# Altium schematic sheet ui_bt_audio.SchDoc: mcHF Pro Transceiver UI board
size A3; Author: Krassi Atanassov; CompanyName: MØNKA; Engineer: For radio amateurs experimentation, non-commercial use only. Thank you!; Revision: 0.8.5; SheetTotal: 13
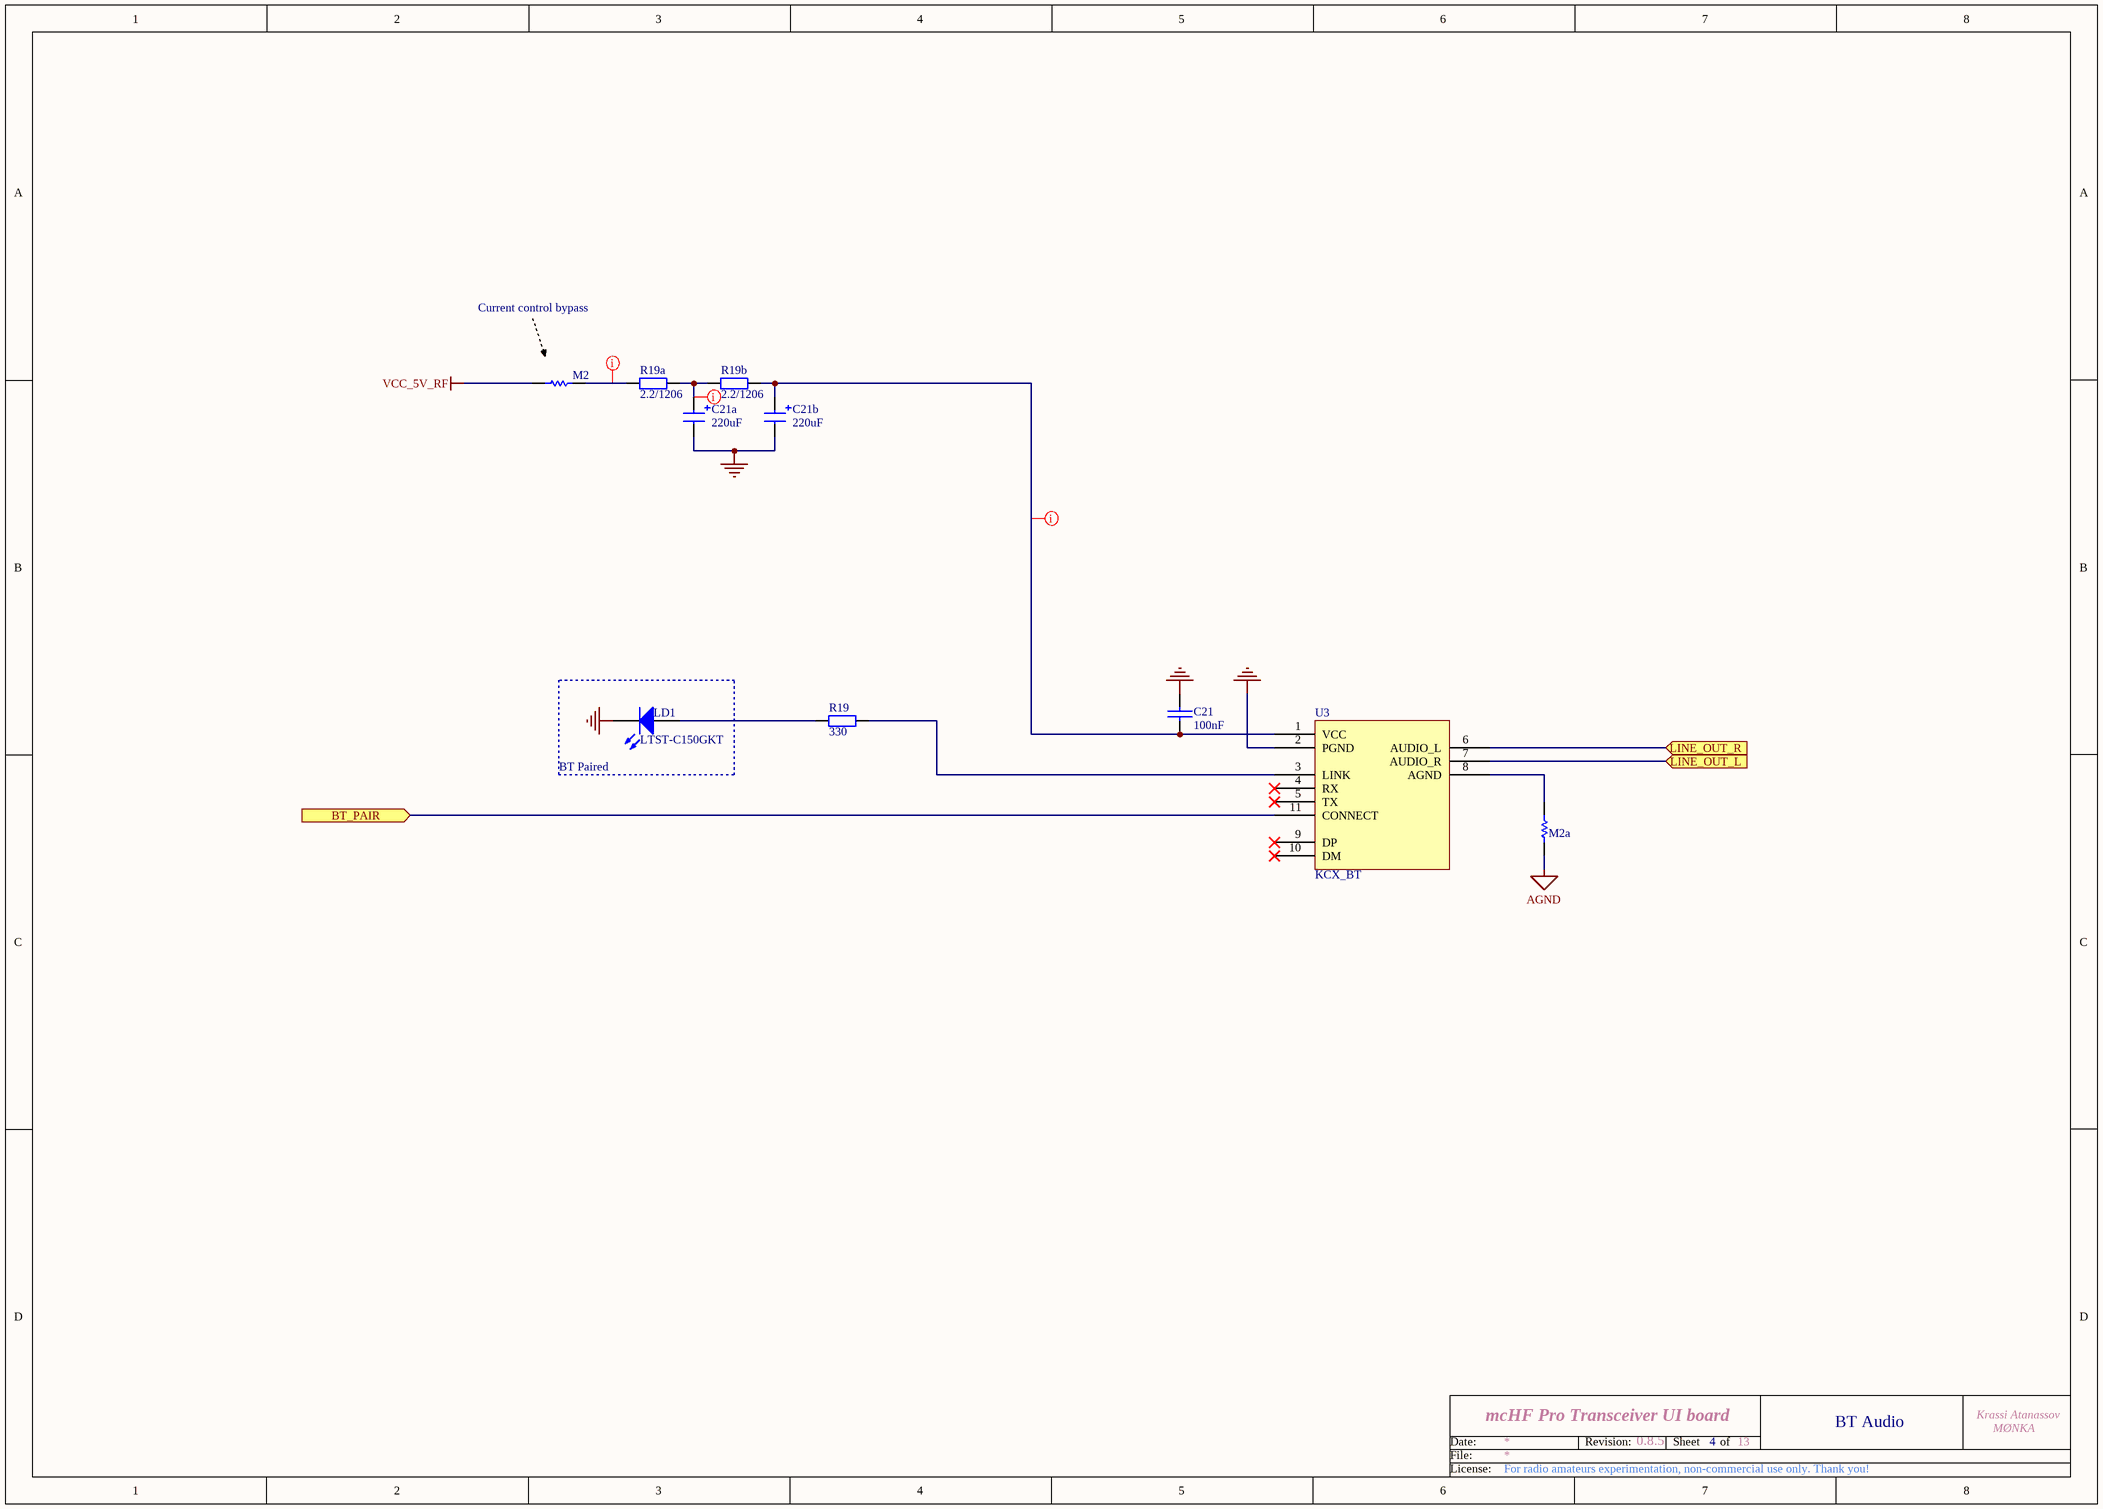
[diagram p0: ui_bt_audio.SchDoc]

## Parts
C21  100nF  [0805]
C21a  220uF  [CAP_ALUM_Pro]
C21b  220uF  [CAP_ALUM_Pro]
LD1  LTST-C150GKT  [1206_Elec_Cap]  (no BOM)
M2  0  [SB_0603]  (value not drawn)  (net tie, no BOM)
M2a  0  [SB_0603]  (value not drawn)  (net tie, no BOM)
R19  330  [0805]
R19a  2.2/1206  [1206]
R19b  2.2/1206  [1206]
U3  KCX_BT  [KCX_BT]

## Blocks framed on the sheet
BT Paired: LD1

## Ports
BT_PAIR (in), LINE_OUT_L (in), LINE_OUT_R (in)

## Nets
AGND: M2a.1
GND: C21.1 C21a.2 C21b.2 LD1.2(K) U3.2(PGND)
VCC_5V_RF: M2.1
BT_PAIR: U3.11(CONNECT) ; port BT_PAIR
LINE_OUT_L: U3.7(AUDIO_R) ; port LINE_OUT_L
LINE_OUT_R: U3.6(AUDIO_L) ; port LINE_OUT_R
NetC21_2: C21.2 C21b.1 R19b.2 U3.1(VCC)
NetC21a_1: C21a.1 R19a.2 R19b.1
NetLD1_1: LD1.1(A) R19.2
NetM2_2: M2.2 R19a.1
NetM2a_2: M2a.2 U3.8(AGND)
NetR19_1: R19.1 U3.3(LINK)

Not connected (* = marked no-connect by the designer): U3 4(RX)* 5(TX)* 9(DP)* 10(DM)*

## Layout directives
rule Width Constraint [Pref Width = 12mil    Min Width = 12mil    Max Width = 12mil]: NetC21_2, NetC21a_1, NetM2_2

## Notes on the sheet
- Current control bypass
- 4
- BT Audio
- Date:
- File:
- Revision:
- Sheet
- of
- License:

## Library data of the parts
C21 = CAP: Capacitor; Order: FN 252-2090; QT Order: QCC-00154; Price: 0.068
C21a = CAP-POL: Electrolitic capacitor; Order: FN 225-4321; QT Order: QCC-00320; Price: 0.34
C21b = CAP-POL: Electrolitic capacitor; Notes: Aluminium capacitor; Price: 0.34
LD1 = LED2: LED 3mm; QT Order: QCD-00052; Revision: July-2002: Re-released for DXP Platform.; Price: 0.116
M2 M2a = Link: Value: 1K; Published: 8-Jun-2000; Revision: July-2002: Re-released for DXP Platform.; Publisher: Altium Limited
R19 = RES: Resistor; Order: FN 146-9899; QT Order: QCR-00309; Price: 0.023
R19a R19b = RES: Resistor; Order: FN 207-8984; QT Order: QCR-00412; Price: 0.02
U3 = KCX_BT: KCX_BT_EMITTER V 1.7